# Altium schematic sheet ESP32.SchDoc
size A4; SheetNumber: 4; SheetTotal: 10
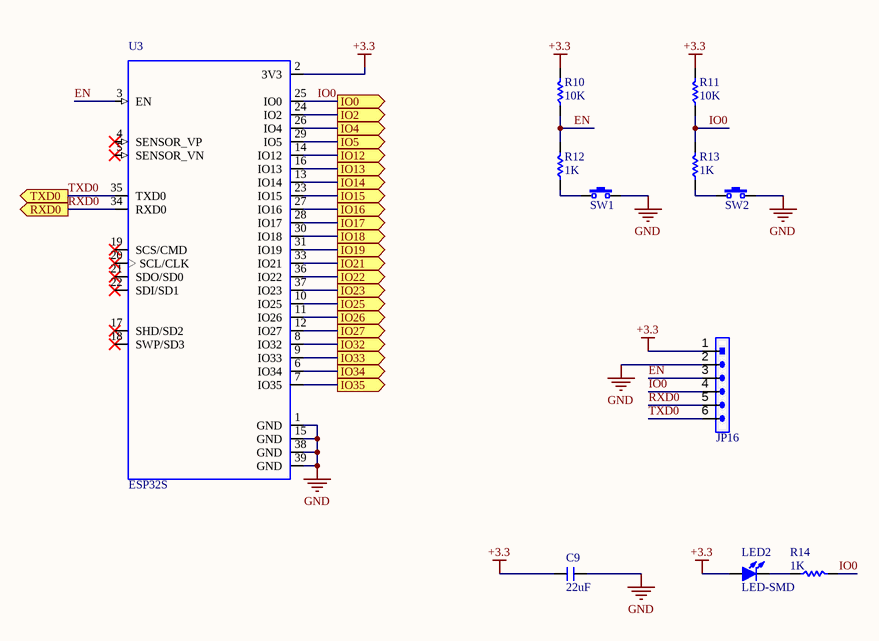
[diagram p0: ESP32.SchDoc]

## Parts
C9  22uF  [C 0805]
JP16  HDR-1X6  [HDR-1X6]  (value not drawn)
LED2  LED-SMD  [LED 0805B]
R10  10K  [R 0805]
R11  10K  [R 0805]
R12  1K  [R 0805]
R13  1K  [R 0805]
R14  1K  [R 0805]
SW1  3x6x5  [TSW SMD-3*6*2.5]  (value not drawn)
SW2  3x6x5  [TSW SMD-3*6*2.5]  (value not drawn)
U3  ESP32S  [ESP32S]

## Ports
IO0 (out), IO2 (out), IO4 (out), IO5 (out), IO12 (out), IO13 (out), IO14 (out), IO15 (out), IO16 (out), IO17 (out), IO18 (out), IO19 (out), IO21 (out), IO22 (out), IO23 (out), IO25 (out), IO26 (out), IO27 (out), IO32 (out), IO33 (out), IO34 (out), IO35 (out), RXD0 (out), TXD0 (out)

## Nets
+3.3: C9.1 JP16.1 LED2.1(A) R10.2 R11.2 U3.2(3V3)
GND: C9.2 JP16.2 SW1.2 SW2.2 U3.1(GND) U3.15(GND) U3.38(GND) U3.39(GND)
EN: JP16.3 R10.1 R12.2 U3.3(EN)
IO0: JP16.4 R11.1 R13.2 R14.2 U3.25(IO0) ; port IO0
IO2: U3.24(IO2) ; port IO2
IO4: U3.26(IO4) ; port IO4
IO5: U3.29(IO5) ; port IO5
IO12: U3.14(IO12) ; port IO12
IO13: U3.16(IO13) ; port IO13
IO14: U3.13(IO14) ; port IO14
IO15: U3.23(IO15) ; port IO15
IO16: U3.27(IO16) ; port IO16
IO17: U3.28(IO17) ; port IO17
IO18: U3.30(IO18) ; port IO18
IO19: U3.31(IO19) ; port IO19
IO21: U3.33(IO21) ; port IO21
IO22: U3.36(IO22) ; port IO22
IO23: U3.37(IO23) ; port IO23
IO25: U3.10(IO25) ; port IO25
IO26: U3.11(IO26) ; port IO26
IO27: U3.12(IO27) ; port IO27
IO32: U3.8(IO32) ; port IO32
IO33: U3.9(IO33) ; port IO33
IO34: U3.6(IO34) ; port IO34
IO35: U3.7(IO35) ; port IO35
RXD0: JP16.5 U3.34(RXD0) ; port RXD0
TXD0: JP16.6 U3.35(TXD0) ; port TXD0
NetLED2_2: LED2.2(K) R14.1
NetR12_1: R12.1 SW1.1
NetR13_1: R13.1 SW2.1

Not connected (* = marked no-connect by the designer): U3 4(SENSOR_VP)* 5(SENSOR_VN)* 17(SHD/SD2)* 18(SWP/SD3)* 19(SCS/CMD)* 20(SCL/CLK)* 21(SDO/SD0)* 22(SDI/SD1)*

## Library data of the parts
C9 = C: Non-polar patch capacitor; BOM名称: 无极性贴片电容; 版权归属: 源创客; 学习资源: www.ooocke.com
JP16 = Header 6: 6P Connector; BOM名称: 6P接插件; 版权归属: 源创客; 学习资源: www.ooocke.com
LED2 = LED-SMD: Patch LED; BOM名称: 贴片LED; 版权归属: 源创客; 学习资源: www.ooocke.com
R10-R14 = R: Chip resistor; 版权归属: 源创客; BOM名称: Chip resistor; 学习资源: www.ooocke.com
SW1 SW2 = TSW 3x6: 3x6 tact switch; BOM名称: 3x6轻触开关; 版权归属: 源创客; 学习资源: www.ooocke.com
U3 = ESP32S: MP: ESP32-WROOM-32D; MF: Espressif Systems; Package: Module Espressif Systems; Price: None; Availability: Unavailable; SnapEDA_Link: https://www.snapeda.com/parts/ESP32-WROOM-32D/Espressif%20Systems/view-part/?ref=snap; Value: *